# Altium project S10985_1.PrjPCB
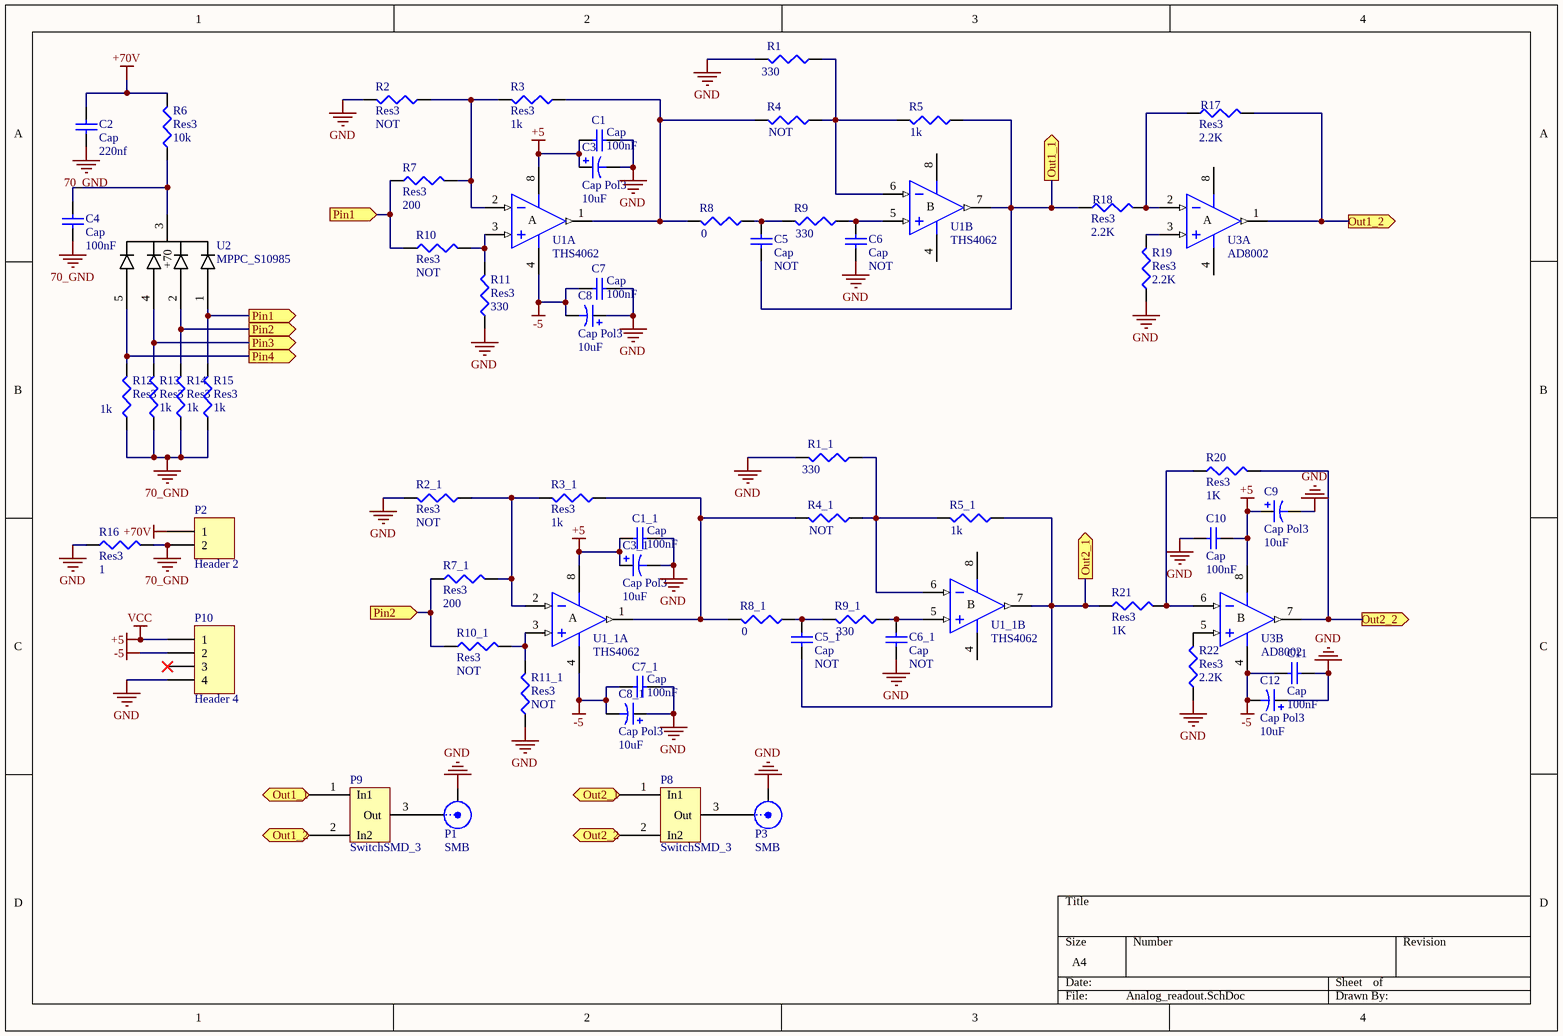
[diagram p0: Analog_readout.SchDoc]
2 sheets, 109 parts. Net scope: flat (ports and power ports of the same name join across sheets).
Board file: Analog_readout.PcbDoc
Sheets:
  Analog_readout.SchDoc
  Analog_readout1.SchDoc

## Sheet Analog_readout.SchDoc: SiPM - S10985
size A4; Author: Rigoberto Chil; CompanyName: LIM - HGGM; DrawnBy: RCP; Engineer: RCP; DocumentName: SiPM - S10985

### Parts
C1  Cap  value 100nF  [6-0805_N]
C1_1  Cap  value 100nF  [6-0805_N]
C2  Cap  value 220nf  [6-0805_N]
C3  Cap Pol3  value 10uF  [6-0805_N]
C3_1  Cap Pol3  value 10uF  [6-0805_N]
C4  Cap  value 100nF  [6-0805_N]
C5  Cap  value NOT  [6-0805_N]
C5_1  Cap  value NOT  [6-0805_N]
C6  Cap  value NOT  [6-0805_N]
C6_1  Cap  value NOT  [6-0805_N]
C7  Cap  value 100nF  [6-0805_N]
C7_1  Cap  value 100nF  [6-0805_N]
C8  Cap Pol3  value 10uF  [6-0805_N]
C8_1  Cap Pol3  value 10uF  [6-0805_N]
C9  Cap Pol3  value 10uF  [6-0805_N]
C10  Cap  value 100nF  [6-0805_N]
C11  Cap  value 100nF  [6-0805_N]
C12  Cap Pol3  value 10uF  [6-0805_N]
P1  SMB  [SMB_V-RJ45]
P2  Header 2  [HDR1X2]
P3  SMB  [SMB_V-RJ45]
P8  SwitchSMD_3  [SwitchSMD_0603]
P9  SwitchSMD_3  [SwitchSMD_0603]
P10  Header 4  [HDR1X4]
R1  value 330  [6-0805_N]  (hidden comment: Res3)
R1_1  value 330  [6-0805_N]  (hidden comment: Res3)
R2  Res3  value NOT  [6-0805_N]
R2_1  Res3  value NOT  [6-0805_N]
R3  Res3  value 1k  [6-0805_N]
R3_1  Res3  value 1k  [6-0805_N]
R4  value NOT  [6-0805_N]  (hidden comment: Res3)
R4_1  value NOT  [6-0805_N]  (hidden comment: Res3)
R5  value 1k  [6-0805_N]  (hidden comment: Res3)
R5_1  value 1k  [6-0805_N]  (hidden comment: Res3)
R6  Res3  value 10k  [6-0805_N]
R7  Res3  value 200  [6-0805_N]
R7_1  Res3  value 200  [6-0805_N]
R8  value 0  [6-0805_N]  (hidden comment: Res3)
R8_1  value 0  [6-0805_N]  (hidden comment: Res3)
R9  value 330  [6-0805_N]  (hidden comment: Res3)
R9_1  value 330  [6-0805_N]  (hidden comment: Res3)
R10  Res3  value NOT  [6-0805_N]
R10_1  Res3  value NOT  [6-0805_N]
R11  Res3  value 330  [6-0805_N]
R11_1  Res3  value NOT  [6-0805_N]
R12  Res3  value 1k  [6-0805_N]
R13  Res3  value 1k  [6-0805_N]
R14  Res3  value 1k  [6-0805_N]
R15  Res3  value 1k  [6-0805_N]
R16  Res3  value 1  [6-0805_N]
R17  Res3  value 2.2K  [6-0805_N]
R18  Res3  value 2.2K  [6-0805_N]
R19  Res3  value 2.2K  [6-0805_N]
R20  Res3  value 1K  [6-0805_N]
R21  Res3  value 1K  [6-0805_N]
R22  Res3  value 2.2K  [6-0805_N]
U1  THS4062  [SO-8_M]  (parts A,B of 2)
U1_1  THS4062  [SO-8_M]  (parts A,B of 2)
U2  MPPC_S10985  [S10985_HAM]
U3  AD8002  [SO-8_M]  (parts A,B of 2)

### Ports
Out1_1 (out), Out1_2 (out), Out2_1 (out), Out2_2 (out), Pin1 (in), Pin1 (out), Pin2 (in), Pin2 (out), Pin3 (out), Pin4 (out)

### Nets
70_GND: C2.1 C4.1 P2.2 R12.1 R13.1 R14.1 R15.1 R16.2
+5: C1.2 C1_1.2 C3.1 C3_1.1 C9.1 C10.2 P10.1 U1.8(V+) U1_1.8(V+) U3.8(V+)  [also labelled VCC]
+70V: C2.2 P2.1 R6.2
-5: C7.2 C7_1.2 C8.2 C8_1.2 C11.1 C12.2 P10.2 U1.4(V-) U1_1.4(V-) U3.4(V-)
GND: C1.1 C1_1.1 C3.2 C3_1.2 C6.2 C6_1.2 C7.1 C7_1.1 C8.1 C8_1.1 C9.2 C10.1 C11.2 C12.1 P1.2(Y) P3.2(Y) P10.4 R1.2 R1_1.2 R2.2 R2_1.2 R11.1 R11_1.1 R16.1 R19.1 R22.1
NetC4_2: C4.2 R6.1 U2.3(+70)
NetC5_1: C5.1 R8.1 R9.2
NetC5_1_1: C5_1.1 R8_1.1 R9_1.2
NetC5_1_2: C5_1.2 P8.1(In1) R5_1.1 R21.1 U1_1.7(OUT) ; port Out2_1
NetC5_2: C5.2 P9.1(In1) R5.1 R18.1 U1.7(OUT) ; port Out1_1
NetC6_1: C6.1 R9.1 U1.5(IN+)
NetC6_1_1: C6_1.1 R9_1.1 U1_1.5(IN+)
NetP1_1: P1.1(X) P9.3(Out)
NetP3_1: P3.1(X) P8.3(Out)
NetP8_2: P8.2(In2) R20.2 U3.7(OUT) ; port Out2_2
NetP9_2: P9.2(In2) R17.2 U3.1(OUT) ; port Out1_2
NetR1_1: R1.1 R4.1 R5.2 U1.6(IN-)
NetR1_1_1: R1_1.1 R4_1.1 R5_1.2 U1_1.6(IN-)
NetR2_1: R2.1 R3.2 R7.2 U1.2(IN-)
NetR2_1_1: R2_1.1 R3_1.2 R7_1.2 U1_1.2(IN-)
NetR3_1: R3.1 R4.2 R8.2 U1.1(OUT)
NetR3_1_1: R3_1.1 R4_1.2 R8_1.2 U1_1.1(OUT)
NetR7_1: R7.1 R10.1 R15.2 U2.1(Pin1) ; port Pin1
NetR7_1_1: R7_1.1 R10_1.1 R14.2 U2.2(Pin2) ; port Pin2
NetR7_2_1: R13.2 U2.4 ; port Pin3
NetR7_3_1: R12.2 U2.5 ; port Pin4
NetR10_1_2: R10_1.2 R11_1.2 U1_1.3(IN+)
NetR10_2: R10.2 R11.2 U1.3(IN+)
NetR17_1: R17.1 R18.2 U3.2(IN-)
NetR19_2: R19.2 U3.3(IN+)
NetR20_1: R20.1 R21.2 U3.6(IN-)
NetR22_2: R22.2 U3.5(IN+)

Not connected (* = marked no-connect by the designer): P10 3*

### Notes on the sheet
- (in symbol AD8002AR, part A) A
- (in symbol AD8002AR, part B) B

### Library data of the parts
C1 C1_1 C2 C4 C5 C5_1 C6 C6_1 C7 C7_1 C10 C11 = Cap: Capacitor; Published: 8-Jun-2000; LatestRevisionDate: 17-Jul-2002; LatestRevisionNote: Re-released for DXP Platform.; PackageReference: RAD-0.3; Publisher: Altium Limited; PackageDescription: Radial Cap, Thru-Hole; 2 Leads; 0.3 in Pin Spacing
C3 C3_1 C8 C8_1 C9 C12 = Cap Pol3: Polarized Capacitor (Surface Mount); Published: 8-Jun-2000; LatestRevisionDate: 29-May-2009; LatestRevisionNote: IPC-7351 Footprint Added.; PackageReference: C0805; Publisher: Altium Limited; PackageDescription: Chip Capacitor
P1 P3 = SMB: SMB Straight Connector; LatestRevisionDate: 17-Jul-2002; LatestRevisionNote: Re-released for DXP Platform.; Publisher: Altium Limited
P2 = Header 2: Header, 2-Pin; LatestRevisionDate: 17-Jul-2002; LatestRevisionNote: Re-released for DXP Platform.; Publisher: Altium Limited
P10 = Header 4: Header, 4-Pin; LatestRevisionDate: 17-Jul-2002; LatestRevisionNote: Re-released for DXP Platform.; Publisher: Altium Limited
R1 R1_1 R2 R2_1 R3 R3_1 R4 R4_1 R5 R5_1 R6 R7 R7_1 R8 R8_1 R9 R9_1 R10 R10_1 R11 R11_1 R12-R22 = Res3: Resistor; Published: 8-Jun-2000; LatestRevisionDate: 29-May-2009; LatestRevisionNote: IPC-7351 Footprint Added.; PackageReference: J1-0603; Publisher: Altium Limited; PackageDescription: Chip Resistor
U1 U1_1 U3 = AD8002AR: Dual 600MHz, 50mW Current Feedback Amplifier; Published: 8-Jun-2000; LatestRevisionDate: 13-Apr-2006; LatestRevisionNote: IPC-7351 Footprint Added.; DatasheetVersion: REV. C 1999; PackageVersion: revA; PackageReference: SO-8; Publisher: Altium Limited; PackageDescription: 8-Pin Small Outline Integrated Circuit 1.27 mm Pitch; Code_JEDEC: MS-012-AA; Code_IPC: SOIC127P600-8; ComponentLink1Description: Manufacturer Link; ComponentLink1URL: http://www.analog.com/en/prod/0,,759_786_AD8002%2C00.html; ComponentLink2Description: Datasheet; ComponentLink2URL: http://www.analog.com/UploadedFiles/Data_Sheets/147523773AD8002_d.pdf

## Sheet Analog_readout1.SchDoc
size A4
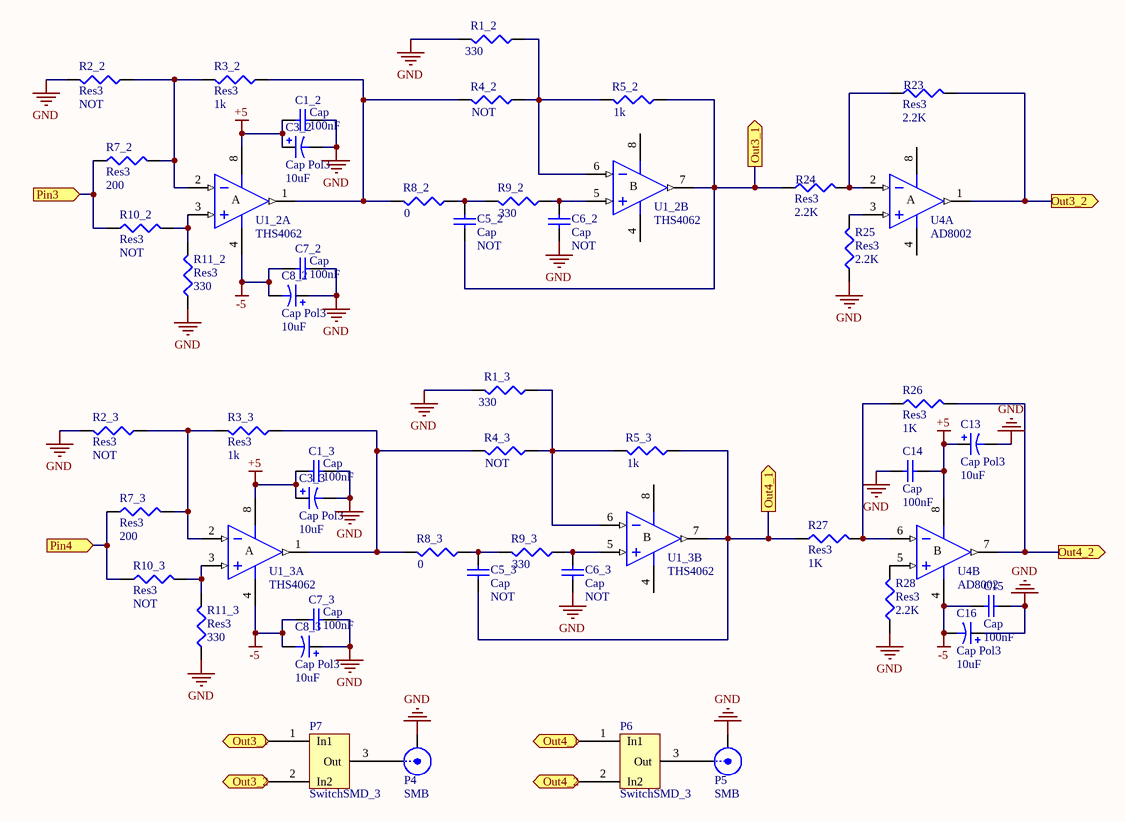
[diagram p1: Analog_readout1.SchDoc]

### Parts
C1_2  Cap  value 100nF  [6-0805_N]
C1_3  Cap  value 100nF  [6-0805_N]
C3_2  Cap Pol3  value 10uF  [6-0805_N]
C3_3  Cap Pol3  value 10uF  [6-0805_N]
C5_2  Cap  value NOT  [6-0805_N]
C5_3  Cap  value NOT  [6-0805_N]
C6_2  Cap  value NOT  [6-0805_N]
C6_3  Cap  value NOT  [6-0805_N]
C7_2  Cap  value 100nF  [6-0805_N]
C7_3  Cap  value 100nF  [6-0805_N]
C8_2  Cap Pol3  value 10uF  [6-0805_N]
C8_3  Cap Pol3  value 10uF  [6-0805_N]
C13  Cap Pol3  value 10uF  [6-0805_N]
C14  Cap  value 100nF  [6-0805_N]
C15  Cap  value 100nF  [6-0805_N]
C16  Cap Pol3  value 10uF  [6-0805_N]
P4  SMB  [SMB_V-RJ45]
P5  SMB  [SMB_V-RJ45]
P6  SwitchSMD_3  [SwitchSMD_0603]
P7  SwitchSMD_3  [SwitchSMD_0603]
R1_2  value 330  [6-0805_N]  (hidden comment: Res3)
R1_3  value 330  [6-0805_N]  (hidden comment: Res3)
R2_2  Res3  value NOT  [6-0805_N]
R2_3  Res3  value NOT  [6-0805_N]
R3_2  Res3  value 1k  [6-0805_N]
R3_3  Res3  value 1k  [6-0805_N]
R4_2  value NOT  [6-0805_N]  (hidden comment: Res3)
R4_3  value NOT  [6-0805_N]  (hidden comment: Res3)
R5_2  value 1k  [6-0805_N]  (hidden comment: Res3)
R5_3  value 1k  [6-0805_N]  (hidden comment: Res3)
R7_2  Res3  value 200  [6-0805_N]
R7_3  Res3  value 200  [6-0805_N]
R8_2  value 0  [6-0805_N]  (hidden comment: Res3)
R8_3  value 0  [6-0805_N]  (hidden comment: Res3)
R9_2  value 330  [6-0805_N]  (hidden comment: Res3)
R9_3  value 330  [6-0805_N]  (hidden comment: Res3)
R10_2  Res3  value NOT  [6-0805_N]
R10_3  Res3  value NOT  [6-0805_N]
R11_2  Res3  value 330  [6-0805_N]
R11_3  Res3  value 330  [6-0805_N]
R23  Res3  value 2.2K  [6-0805_N]
R24  Res3  value 2.2K  [6-0805_N]
R25  Res3  value 2.2K  [6-0805_N]
R26  Res3  value 1K  [6-0805_N]
R27  Res3  value 1K  [6-0805_N]
R28  Res3  value 2.2K  [6-0805_N]
U1_2  THS4062  [SO-8_M]  (parts A,B of 2)
U1_3  THS4062  [SO-8_M]  (parts A,B of 2)
U4  AD8002  [SO-8_M]  (parts A,B of 2)

### Ports
Out3_1 (out), Out3_2 (out), Out4_1 (out), Out4_2 (out), Pin3 (in), Pin4 (in)

### Nets
+5: C1_2.2 C1_3.2 C3_2.1 C3_3.1 C13.1 C14.2 U1_2.8(V+) U1_3.8(V+) U4.8(V+)
-5: C7_2.2 C7_3.2 C8_2.2 C8_3.2 C15.1 C16.2 U1_2.4(V-) U1_3.4(V-) U4.4(V-)
GND: C1_2.1 C1_3.1 C3_2.2 C3_3.2 C6_2.2 C6_3.2 C7_2.1 C7_3.1 C8_2.1 C8_3.1 C13.2 C14.1 C15.2 C16.1 P4.2(Y) P5.2(Y) R1_2.2 R1_3.2 R2_2.2 R2_3.2 R11_2.1 R11_3.1 R25.1 R28.1
NetC5_2_1: C5_2.1 R8_2.1 R9_2.2
NetC5_2_2: C5_2.2 P7.1(In1) R5_2.1 R24.1 U1_2.7(OUT) ; port Out3_1
NetC5_3_1: C5_3.1 R8_3.1 R9_3.2
NetC5_3_2: C5_3.2 P6.1(In1) R5_3.1 R27.1 U1_3.7(OUT) ; port Out4_1
NetC6_2_1: C6_2.1 R9_2.1 U1_2.5(IN+)
NetC6_3_1: C6_3.1 R9_3.1 U1_3.5(IN+)
NetP4_1: P4.1(X) P7.3(Out)
NetP5_1: P5.1(X) P6.3(Out)
NetP6_2: P6.2(In2) R26.2 U4.7(OUT) ; port Out4_2
NetP7_2: P7.2(In2) R23.2 U4.1(OUT) ; port Out3_2
NetR1_2_1: R1_2.1 R4_2.1 R5_2.2 U1_2.6(IN-)
NetR1_3_1: R1_3.1 R4_3.1 R5_3.2 U1_3.6(IN-)
NetR2_2_1: R2_2.1 R3_2.2 R7_2.2 U1_2.2(IN-)
NetR2_3_1: R2_3.1 R3_3.2 R7_3.2 U1_3.2(IN-)
NetR3_2_1: R3_2.1 R4_2.2 R8_2.2 U1_2.1(OUT)
NetR3_3_1: R3_3.1 R4_3.2 R8_3.2 U1_3.1(OUT)
NetR7_2_1: R7_2.1 R10_2.1 ; port Pin3
NetR7_3_1: R7_3.1 R10_3.1 ; port Pin4
NetR10_2_2: R10_2.2 R11_2.2 U1_2.3(IN+)
NetR10_3_2: R10_3.2 R11_3.2 U1_3.3(IN+)
NetR23_1: R23.1 R24.2 U4.2(IN-)
NetR25_2: R25.2 U4.3(IN+)
NetR26_1: R26.1 R27.2 U4.6(IN-)
NetR28_2: R28.2 U4.5(IN+)

### Notes on the sheet
- (in symbol AD8002AR, part A) A
- (in symbol AD8002AR, part B) B

### Library data of the parts
C1_2 C1_3 C5_2 C5_3 C6_2 C6_3 C7_2 C7_3 C14 C15 = Cap: Capacitor; Published: 8-Jun-2000; LatestRevisionDate: 17-Jul-2002; LatestRevisionNote: Re-released for DXP Platform.; PackageReference: RAD-0.3; Publisher: Altium Limited; PackageDescription: Radial Cap, Thru-Hole; 2 Leads; 0.3 in Pin Spacing
C3_2 C3_3 C8_2 C8_3 C13 C16 = Cap Pol3: Polarized Capacitor (Surface Mount); Published: 8-Jun-2000; LatestRevisionDate: 29-May-2009; LatestRevisionNote: IPC-7351 Footprint Added.; PackageReference: C0805; Publisher: Altium Limited; PackageDescription: Chip Capacitor
P4 P5 = SMB: SMB Straight Connector; LatestRevisionDate: 17-Jul-2002; LatestRevisionNote: Re-released for DXP Platform.; Publisher: Altium Limited
R1_2 R1_3 R2_2 R2_3 R3_2 R3_3 R4_2 R4_3 R5_2 R5_3 R7_2 R7_3 R8_2 R8_3 R9_2 R9_3 R10_2 R10_3 R11_2 R11_3 R23-R28 = Res3: Resistor; Published: 8-Jun-2000; LatestRevisionDate: 29-May-2009; LatestRevisionNote: IPC-7351 Footprint Added.; PackageReference: J1-0603; Publisher: Altium Limited; PackageDescription: Chip Resistor
U1_2 U1_3 U4 = AD8002AR: as U1 on sheet Analog_readout; Published: 8-Jun-2000; LatestRevisionDate: 13-Apr-2006; LatestRevisionNote: IPC-7351 Footprint Added.; DatasheetVersion: REV. C 1999; PackageVersion: revA; PackageReference: SO-8; Publisher: Altium Limited; PackageDescription: 8-Pin Small Outline Integrated Circuit 1.27 mm Pitch; Code_JEDEC: MS-012-AA; Code_IPC: SOIC127P600-8; ComponentLink1Description: Manufacturer Link; ComponentLink1URL: http://www.analog.com/en/prod/0,,759_786_AD8002%2C00.html; ComponentLink2Description: Datasheet; ComponentLink2URL: http://www.analog.com/UploadedFiles/Data_Sheets/147523773AD8002_d.pdf

## Nets that join several sheets
+5: Analog_readout (10 pins), Analog_readout1 (9 pins)
-5: Analog_readout (10 pins), Analog_readout1 (9 pins)
GND: Analog_readout (26 pins), Analog_readout1 (24 pins)
NetR7_2_1: Analog_readout (R13.2 U2.4), Analog_readout1 (R7_2.1 R10_2.1)
NetR7_3_1: Analog_readout (R12.2 U2.5), Analog_readout1 (R7_3.1 R10_3.1)